# EAGLE design WeatherBoard_v2.0 (EAGLE 9.4.1)
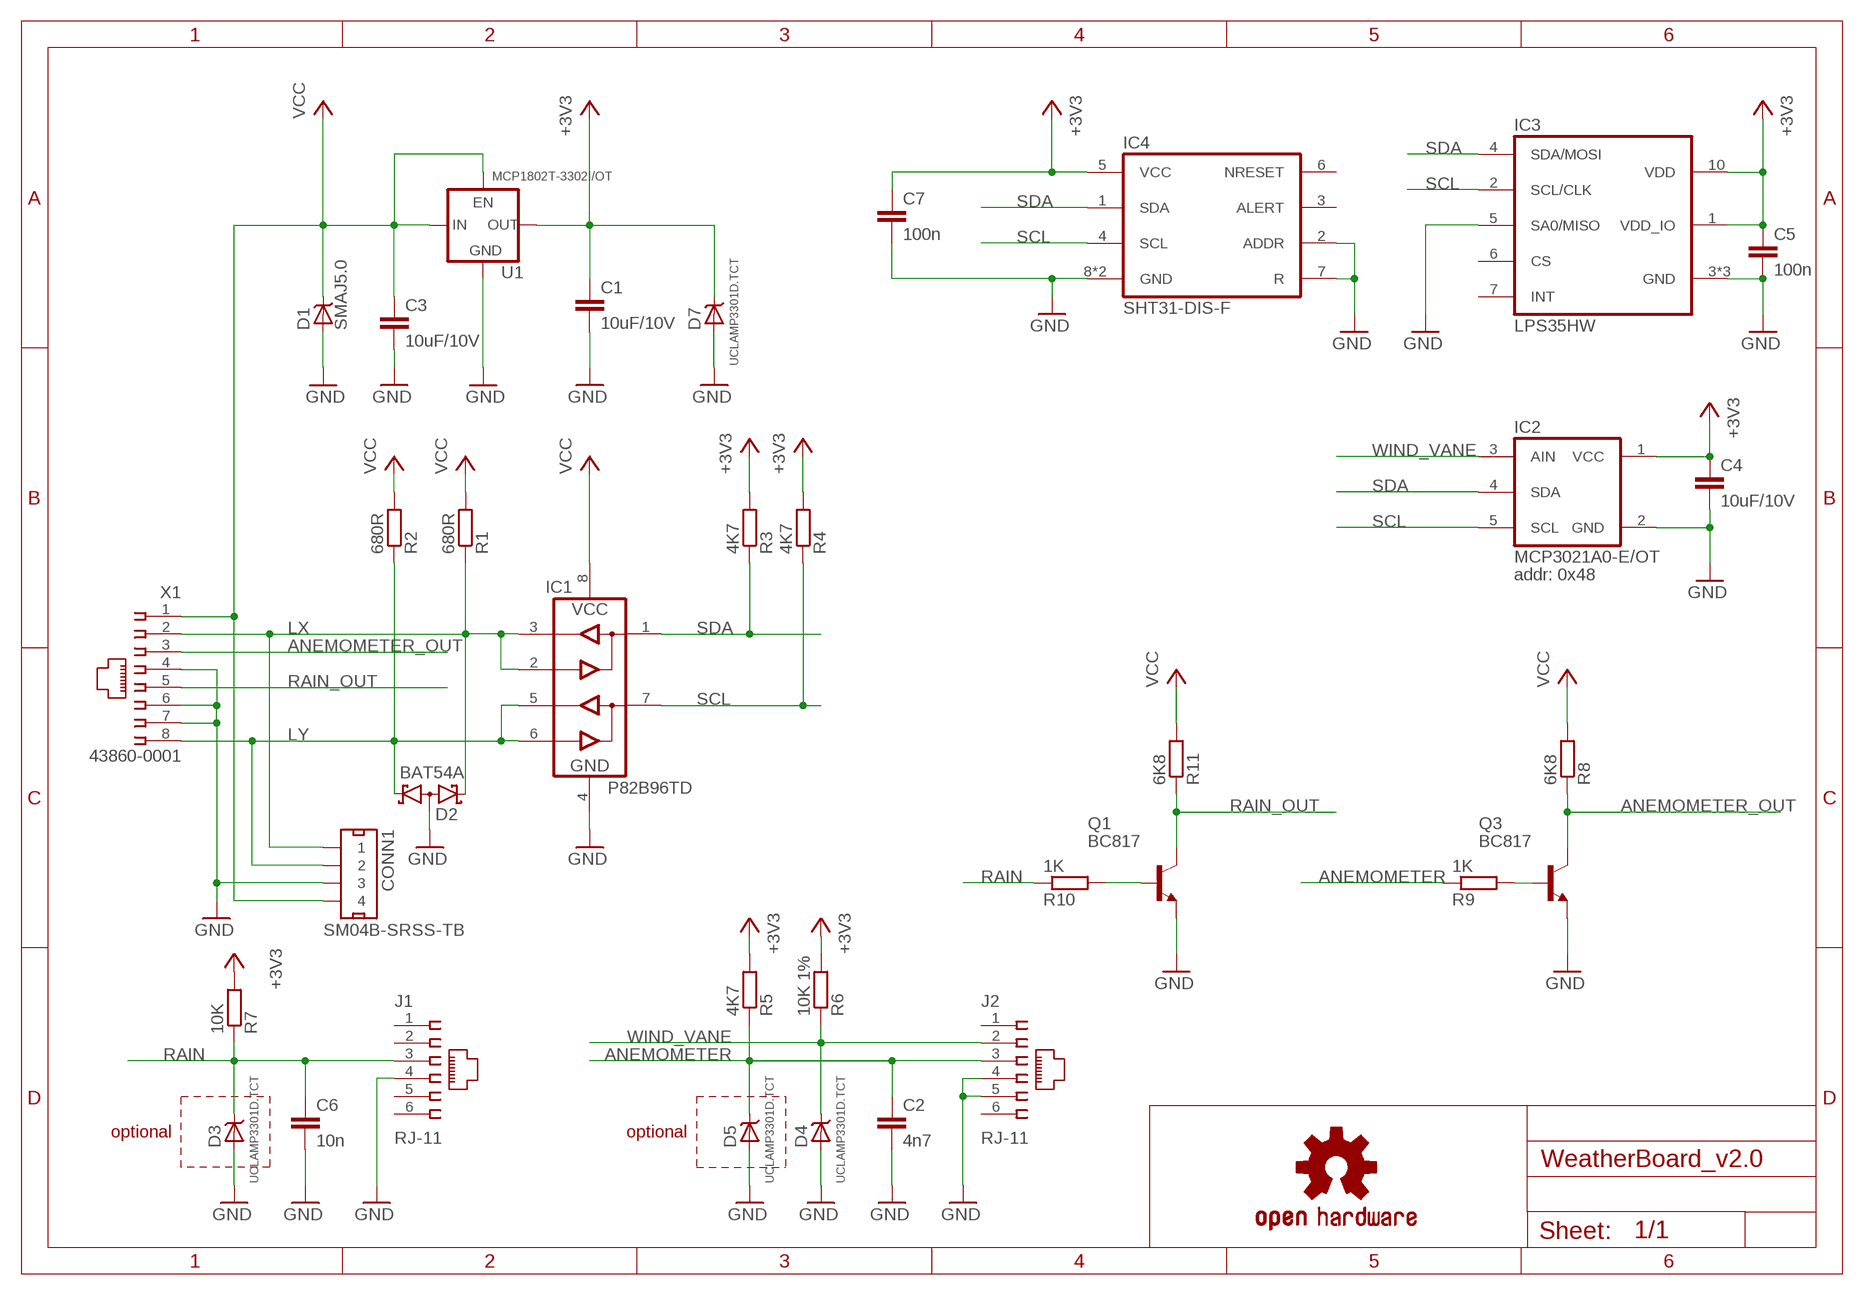
[diagram p0: schematic, sheet 1]

## Parts
C1  10uF/10V  C-EUC0805  [C0805]
C2  4n7  C-EUC0805  [C0805]
C3  10uF/10V  C-EUC0805  [C0805]
C4  10uF/10V  C-EUC0805  [C0805]
C5  100n  C-EUC0805  [C0805]
C6  10n  C-EUC0805  [C0805]
C7  100n  C-EUC0805  [C0805]
CONN1  SM04B-SRSS-TB  [JST-SRSS-4-T]
D1  SMAJ5.0  [DO214AC]
D2  BAT54A  [SOT23]
D3  UCLAMP3301D.TCT  [SOD323]
D4  UCLAMP3301D.TCT  [SOD323]
D5  UCLAMP3301D.TCT  [SOD323]
D7  UCLAMP3301D.TCT  [SOD323]
IC1  P82B96TD  [SO08]
IC2  MCP3021A0-E/OT  [SOT23-5]
IC3  LPS35HW  [CCLGA10L]
IC4  SHT31-DIS-F  SHT31-DIS  [DFN8]
J1  RJ-11  [615006138421]
J2  RJ-11  [615006138421]
LOGO1  OSHW-LOGOM-COPPER  [OSHW-LOGO-M_COPPER]
Q1  BC817  BC817-40SMD  [SOT23-BEC]
Q3  BC817  BC817-40SMD  [SOT23-BEC]
R1  680R  R-EU_R0805  [R0805]
R2  680R  R-EU_R0805  [R0805]
R3  4K7  R-EU_R0805  [R0805]
R4  4K7  R-EU_R0805  [R0805]
R5  4K7  R-EU_R0805  [R0805]
R6  10K 1%  R-EU_R0805  [R0805]
R7  10K  R-EU_R0805  [R0805]
R8  6K8  R-EU_R0805  [R0805]
R9  1K  R-EU_R0805  [R0805]
R10  1K  R-EU_R0805  [R0805]
R11  6K8  R-EU_R0805  [R0805]
U1  MCP1802T-3302I/OT  TLV70033DD  [SOT23-5]
X1  43860-0001  [MX-43860-0001]

## Nets
+3V3: C1.1 C4.1 C5.1 C7.1 D7.C IC2.1(VCC) IC3.1(VDD_IO) IC3.10(VDD) IC4.5(VCC) R3.2 R4.2 R5.2 R6.2 R7.2 U1.5(VOUT)
ANEMOMETER: C2.1 D5.C J2.3 R5.1 R9.1
ANEMOMETER_OUT: Q3.C R8.1 X1.3
GND: C1.2 C2.2 C3.2 C4.2 C5.2 C6.2 C7.2 CONN1.3 D1.A D2.3(AA) D3.A D4.A D5.A D7.A IC1.4(GND) IC2.2(GND) IC3.3(GND) IC3.5(SA0/MISO) IC3.8(GND) IC3.9(GND) IC4.2(ADDR) IC4.7(R) IC4.8(GND) IC4.PAD(GND) J1.4 J2.4 J2.5 Q1.E Q3.E U1.2(GND) X1.4 X1.6 X1.7
LX: CONN1.1 D2.2(K2) IC1.2(RX) IC1.3(TX) R1.1 X1.2
LY: CONN1.2 D2.1(K1) IC1.5(TY) IC1.6(RY) R2.1 X1.8
N$1: Q3.B R9.2
N$2: Q1.B R10.2
RAIN: C6.1 D3.C J1.3 R7.1 R10.1
RAIN_OUT: Q1.C R11.1 X1.5
SCL: IC1.7(SY) IC2.5(SCL) IC3.2(SCL/CLK) IC4.4(SCL) R4.1
SDA: IC1.1(SX) IC2.4(SDA) IC3.4(SDA/MOSI) IC4.1(SDA) R3.1
VCC: C3.1 CONN1.4 D1.C IC1.8(VCC) R1.2 R2.2 R8.2 R11.2 U1.1(VIN) U1.3(EN) X1.1
WIND_VANE: D4.C IC2.3(AIN) J2.2 R6.1
Unconnected: CONN1.NC1(PAD2) CONN1.NC2(PAD1) IC3.6(CS) IC3.7(INT) IC4.3(ALERT) IC4.6(NRESET) J1.1 J1.2 J1.5 J1.6 J2.1 J2.6

## Notes on the sheet
- addr: 0x48
- optional | optional

## Library data of the parts
C1-C7 = rcl:C-EU: CAPACITOR, European symbol; SPICEPREFIX: C
CONN1 = my-connectors:?M04B-SRSS-TB: JST SR 4 Pin Connector 1mm Pitch
D1 = my-diode:SM?J*: Transient Voltage Suppression Diode - TVS
D2 = diode:BAT54A: Schottky Diodes Source: Fairchild .. BAT54.pdf
D3-D5 D7 = my-diode:UCLAMP3301?.TCT: Low Voltage μClamp TVS diode
IC1 = my-ic:P82B96?: Dual bidirectional bus buffer
IC2 = my-ic:MCP3021*-E/?: Low-Power 10-Bit A/D Converter
IC3 = my-ic:LPS35HW: MEMS pressure sensor 260-1260 hPa absolute digital output barometer with water resistant package
IC4 = my-ic:SHT3*-DIS: Humidity and Temperature Sensor
J1 J2 = my-connectors:RJ-11
LOGO1 = SparkFun-Aesthetics:OSHW-LOGO: Open-Source Hardware (OSHW) Logo This logo indicates the piece of hardware it is found on incorporates a OSHW license and/or adheres to the definition of open source hardware found here: http://freedomdefined.org/OSHW
Q1 Q3 = transistor-npn:BC817*: NPN Transistor
R1-R11 = rcl:R-EU_: RESISTOR, European symbol; SPICEPREFIX: R
U1 = my-power:TLV700*: LDO regulator 200mA
X1 = my-connectors:43860-0001: RJ45 8P8C

## Board
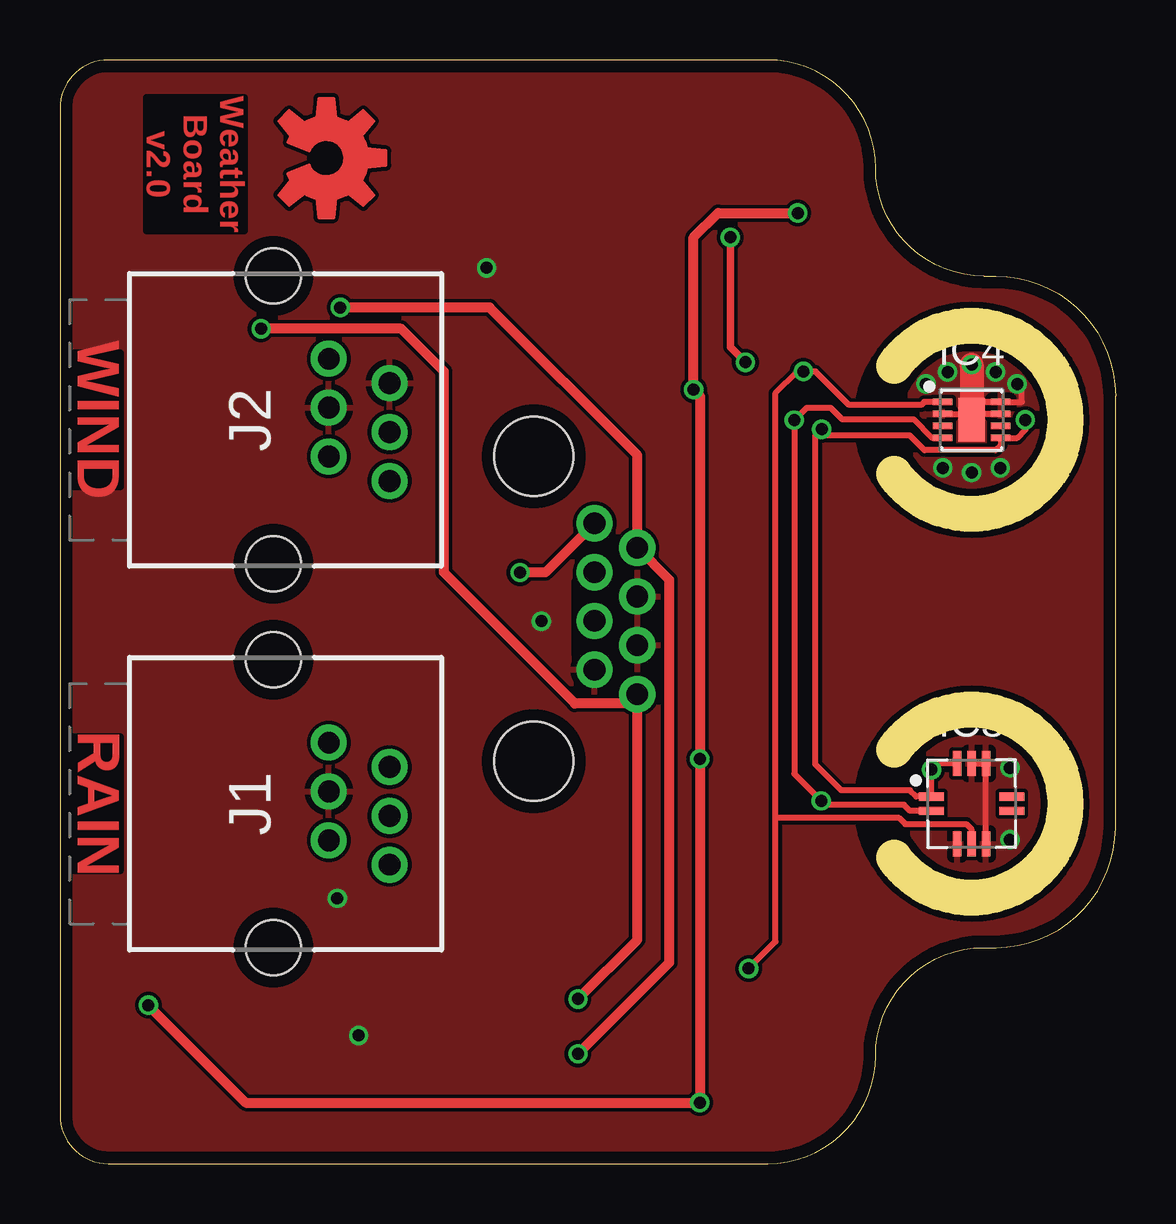
[diagram p1: board, top side]
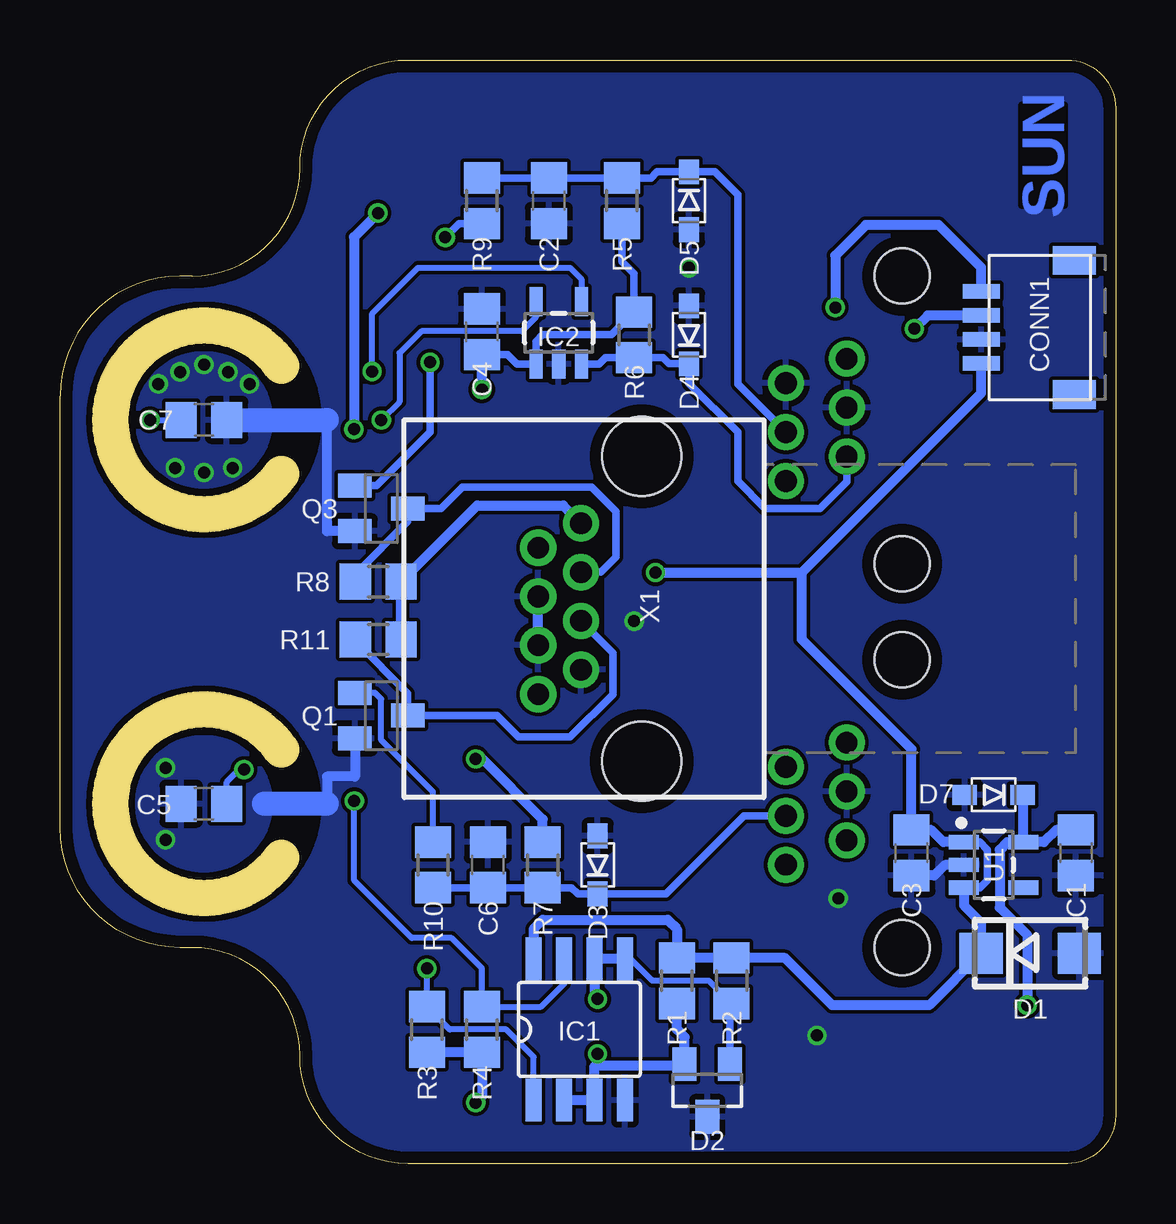
[diagram p2: board, bottom side, seen from below]

Size 44 x 46 mm. Coordinates in mm from the lower left corner, seen from the top.
Outline: 0,44 0,2 arc90 2,0 29.5,0 arc90 34,4.5 arc-90 38.5,9 39,9 arc90 44,14 44,32 arc90 39,37 38.5,37 arc-90 34,41.5 arc90 29.5,46 2,46 arc90 0,44
Copper layers (1*16): Top 0.035mm / dielectric 1.6mm / Bottom 0.035mm
Design rules "Elecrow_2-layer_PCB_eagle_rule *": minimum track width 6mil, minimum drill 12mil, track to track 6mil, track to pad 6mil, pad to pad 6mil, via to via 8mil, smd to smd 0mil, copper to edge 20mil, drill to drill 10mil, minimum pad ring 12mil, minimum via ring 6mil, stop-mask expansion 0mil, vias tented up to drill 100mil, thermal gap 10mil
Milling: 2 lines

### Footprints (pad centres in the part's own frame; a part is rotated, then mirrored left to right if it is on the bottom)
C0805 = smd 1.3 x 1.5: 1 -0.95,0; 2 0.95,0
JST-SRSS-4-T = smd 0.6 x 1.55: 1 -1.5,-2.45; 2 -0.5,-2.45; 3 0.5,-2.45; 4 1.5,-2.45 | smd 1.2 x 1.8: NC1 -2.8,1.425; NC2 2.8,1.425
DO214AC = smd 1.8 x 1.7: A 2.05,0; C -2.05,0
SOT23 = smd 1 x 1.4: 1 -0.95,-1.1; 2 0.95,-1.1; 3 0,1.1
SOD323 = smd 1.03 x 0.839: A 1.206,0; C -1.206,0
SO08 = smd 0.66 x 1.778: 1 -1.905,-2.946; 2 -0.635,-2.946; 3 0.635,-2.946; 4 1.905,-2.946; 5 1.905,2.946; 6 0.635,2.946; 7 -0.635,2.946; 8 -1.905,2.946
SOT23-5 = smd 0.55 x 1.2: 1 -0.95,-1.3; 2 0,-1.3; 3 0.95,-1.3; 4 0.95,1.3; 5 -0.95,1.3
CCLGA10L = smd 1.05 x 0.35: 1 -1.675,0.3; 2 -1.675,-0.3; 6 1.675,-0.3; 7 1.675,0.3 | smd 0.35 x 1.05: 3 -0.6,-1.675; 4 0,-1.675; 5 0.6,-1.675; 8 0.6,1.675; 9 0,1.675; 10 -0.6,1.675
DFN8 = smd 0.81 x 0.27: 1 -1.21,0.75; 2 -1.21,0.25; 3 -1.21,-0.25; 4 -1.21,-0.75; 5 1.21,-0.75; 6 1.21,-0.25; 7 1.21,0.25; 8 1.21,0.75 | smd 1.1 x 1.8: PAD 0,0
615006138421 = drill 0.9: 1 2.55,4.34; 2 1.53,1.8; 3 0.51,4.34; 4 -0.51,1.8; 5 -1.53,4.34; 6 -2.55,1.8 | hole 2.3: -6,-0.5; 6,-0.5
SOT23-BEC = smd 1 x 1.4: B -0.95,-1.1; C 0,1.1; E 0.95,-1.1
R0805 = smd 1.3 x 1.5: 1 -0.95,0; 2 0.95,0
SOT23-5' = smd 1.247 x 0.597: 1 -1.237,0.95; 2 -1.237,0; 3 -1.237,-0.95; 4 1.237,-0.95; 5 1.237,0.95
MX-43860-0001 = drill 0.9: 1 3.56,2.54; 2 2.54,4.32; 3 1.52,2.54; 4 0.51,4.32; 5 -0.51,2.54; 6 -1.52,4.32; 7 -2.54,2.54; 8 -3.56,4.32 | hole 3.3: -6.35,0; 6.35,0

### Placement (x,y rotation side)
C1  1.65,12.95 270 bottom
C2  23.62,40.13 270 bottom
C3  8.51,12.95 270 bottom
C4  26.42,34.67 90 bottom
C5  38,15 180 bottom
C6  26.16,12.45 90 bottom
C7  38,31 0 bottom
CONN1  3.15,34.85 270 bottom
D1  3.56,8.76 0 bottom
D2  17.02,3.05 180 bottom
D3  21.59,12.45 90 bottom
D4  17.78,34.54 90 bottom
D5  17.78,40.13 270 bottom
D7  5.08,15.37 180 bottom
IC1  22.35,5.59 0 bottom
IC2  23.21,34.63 0 bottom
IC3  38,15 0 top
IC4  38,31 0 top
J1  9.4,15 270 top
J2  9.4,31 270 top
LOGO1  11.1,41.91 270 top
Q1  30.61,18.67 270 bottom
Q3  30.61,27.3 270 bottom
R1  18.29,7.62 90 bottom
R2  16,7.62 90 bottom
R3  28.7,5.59 270 bottom
R4  26.42,5.59 270 bottom
R5  20.57,40.13 270 bottom
R6  20.07,34.54 90 bottom
R7  23.88,12.45 90 bottom
R8  30.73,24.26 0 bottom
R9  26.42,40.13 270 bottom
R10  28.45,12.45 90 bottom
R11  30.73,21.84 0 bottom
U1  MCP1802T-3302I/OT  [SOT23-5']  5.08,12.45 0 bottom
X1  19.74,23.13 90 bottom

### Tracks (layer width: path | path; a pad name or v marks a point on that pad's centre or on a via)
+3V3  (via drill 0.5)
  Top 0.254: IC3.10 36.59,16.68 v36.33,16.42 v36.33,16.41 IC3.1 35.69,15.3 35.44,15.55 32.56,15.55 31.48,16.64 31.48,30.34 v31.75,30.61 32,30.35 35.42,30.35 36.03,29.74 39,29.74 39.21,29.95 IC4.5 39.9,30.25 40.24,30.59 v40.24,31
  Top 0.406: v3.68,6.6 7.75,2.54 v26.67,2.54 v26.67,16.87 26.67,32 v26.42,32.26 26.42,38.61 27.43,39.62 v30.75,39.62
  Bottom 0.254: v40.24,31 C7.1 | C5.1 37.05,15.9 36.53,16.42 v36.33,16.42
  Bottom 0.305: R5.2 20.57,37.59 20.07,37.08 R6.2 21.02,34.54 23.88,34.54 24.16,34.26 IC2.1 24.95,33.33 25.34,33.72 C4.1
  Bottom 0.406: v26.67,2.54 26.42,2.79 R4.2 R3.2 | v26.42,32.26 C4.1 | R7.2 23.88,14.35 26.39,16.87 v26.67,16.87 | C1.1 2.48,13.9 2.99,13.4 U1.5 | U1.5 4.51,13.4 4.83,13.08 4.83,10.67 3.68,9.53 v3.68,6.6 | v30.75,39.62 31.75,38.62 v31.75,30.61 | D7.C 3.87,13.43 U1.5
ANEMOMETER
  Bottom 0.305: R9.1 C2.1 R5.1 19.37,41.08 19.11,41.34 D5.C 16.7,41.34 15.75,40.39 15.75,32.5 J2.3
ANEMOMETER_OUT
  Bottom 0.305: R8.1 31.68,24.58 29.51,26.75 Q3.C 28.11,27.3 27.22,28.19 21.84,28.19 20.83,27.18 20.83,25.27 21.45,24.65 X1.3
GND  (via drill 0.5)
  Top 0.254: IC3.9 IC3.8 IC3.5 | v39.9,32.5 40.1,32.5 40.1,31.75 IC4.8 38,31.75 IC4.PAD 38,31.25 | IC4.7 38,31.25 | IC4.2 38,31.25
  Top 1: v38,33.3 IC4.PAD
  Bottom 0.406: U1.2 7.11,12.45 7.55,12 C3.2 | X1.6 X1.4 | 32.87,15 32.87,16.13 31.71,16.13 Q1.E | 32.87,31 32.87,26.36 Q3.E
  Bottom 1: C7.2 32.87,31 | 32.87,15 35.5,15
  other vias: 17.78,37.34 11.56,11.05 12.45,5.33 20.07,22.61 37,33 36.1,32.5 39,33 39.2,29 38,28.8 36.8,29 39.6,16.5 39.6,13.5
  cutout Bottom: 23.75,24.26 23.75,20.45 22.73,20.45 22.73,21.21 21.46,21.21 21.46,24.26
  cutout Top: 23.75,24.26 23.75,20.45 22.73,20.45 22.73,21.21 21.46,21.21 21.46,24.26
  cutout Top: 42.8,15 arc90 38,19.8 38,18 arc-90 41,15
  cutout Top: 38,19.8 arc90 33.2,15 35,15 arc-90 38,18
  cutout Top: 33.2,15 arc90 38,10.2 38,12 arc-90 35,15
  cutout Top: 38,10.2 arc90 42.8,15 41,15 arc-90 38,12
  cutout Bottom: 33.2,15 arc-90 38,19.8 38,18 arc90 35,15
  cutout Bottom: 38,10.2 arc-90 33.2,15 35,15 arc90 38,12
  cutout Bottom: 42.8,15 arc-90 38,10.2 38,12 arc90 41,15
  cutout Bottom: 38,19.8 arc-90 42.8,15 41,15 arc90 38,18
  pour Top: 0,44 0,2 arc90 2,0 29.5,0 arc90 34,4.5 arc-90 38.5,9 39,9 arc90 44,14 44,32 arc90 39,37 38.5,37 arc-90 34,41.5 arc90 29.5,46 2,46 arc90
  pour Bottom: 0,44 0,2 arc90 2,0 29.5,0 arc90 34,4.5 arc-90 38.5,9 39,9 arc90 44,14 44,32 arc90 39,37 38.5,37 arc-90 34,41.5 arc90 29.5,46 2,46 arc90
GND2
  cutout Top: 42.8,31 arc90 38,35.8 38,34 arc-90 41,31
  cutout Top: 38,35.8 arc90 33.2,31 35,31 arc-90 38,34
  cutout Top: 33.2,31 arc90 38,26.2 38,28 arc-90 35,31
  cutout Top: 38,26.2 arc90 42.8,31 41,31 arc-90 38,28
  cutout Bottom: 38,35.8 arc-90 42.8,31 41,31 arc90 38,34
  cutout Bottom: 33.2,31 arc-90 38,35.8 38,34 arc90 35,31
  cutout Bottom: 38,26.2 arc-90 33.2,31 35,31 arc90 38,28
  cutout Bottom: 42.8,31 arc-90 38,26.2 38,28 arc90 41,31
LX  (via drill 0.5)
  Top 0.406: v21.59,4.57 25.4,8.38 25.4,24.33 X1.2 24.06,29.53 17.91,35.69 v11.68,35.69
  Bottom 0.406: 21.59,4.06 v21.59,4.57 | 21.59,4.06 18.05,4.06 D2.2 17.97,5.27 18.29,5.59 R1.1 | 21.59,4.06 21.72,4.06 IC1.3 IC1.2 | v11.68,35.69 11.68,37.85 10.41,39.12 7.37,39.12 5.6,37.35 CONN1.1
LY  (via drill 0.5)
  Top 0.406: v21.59,6.86 24.06,9.33 X1.8 23.67,19.18 21.46,19.18 16,24.64 16,33.02 14.22,34.8 v8.38,34.8
  Bottom 0.254: R2.1 16.95,7.62 19.3,7.62 20.22,8.53 IC1.5
  Bottom 0.305: D2.1 16.07,6.6 R2.1
  Bottom 0.406: v21.59,6.86 21.72,6.99 IC1.6 IC1.5 | CONN1.2 7.83,35.35 v8.38,34.8
N$1  (via drill 0.5)
  Top 0.305: v27.94,38.61 27.94,34.04 v28.57,33.4
  Bottom 0.305: R9.2 27.37,39.18 v27.94,38.61 | Q3.B 30.8,28.25 28.57,30.48 v28.57,33.4
N$2
  Bottom 0.254: R10.2 28.45,15.49 30.61,17.65 30.61,19.36 30.87,19.62 Q1.B
RAIN
  Bottom 0.305: R10.1 C6.1 R7.1 22.67,11.5 22.42,11.24 D3.C 18.73,11.24 15.48,14.49 J1.3
RAIN_OUT
  Bottom 0.305: X1.5 20.95,21.29 20.95,19.56 22.73,17.78 24.89,17.78 25.78,18.67 Q1.C 29.51,19.6 31.68,21.78 R11.1
SCL  (via drill 0.5)
  Top 0.254: IC3.2 35.44,14.7 35.18,14.95 31.89,14.95 v31.73,15.11 30.61,16.24 v30.61,30.99 31.11,31.5 32.13,31.5 32.61,31.01 35.59,31.01 36.35,30.25 IC4.4
  Bottom 0.254: IC1.7 22.99,7.49 23.94,6.54 R4.1 26.42,8.13 27.69,9.4 29.34,9.4 31.73,11.79 v31.73,15.11 | IC2.5 24.16,35.27 24.74,34.69 28.93,34.69 29.84,33.78 29.84,31.75 v30.61,30.99
SDA  (via drill 0.5)
  Top 0.254: IC4.1 36.03,31.75 35.9,31.62 32.89,31.62 31.5,33.02 v30.99,33.02 30.73,33.02 29.83,32.12 29.83,14.4 | IC3.4 38,13.93 37.78,14.15 35.24,14.15 34.98,14.4 29.83,14.4 | v28.7,8.13 29.83,9.26 29.83,14.4
  Bottom 0.254: IC1.1 24.26,4.45 25.4,5.59 27.75,5.59 R3.1 v28.7,8.13 | v30.99,33.02 30.99,35.43 29.08,37.34 22.73,37.34 22.26,36.87 IC2.4
VCC  (via drill 0.5)
  Top 0.406: X1.1 20.23,24.64 v19.18,24.64
  Bottom 0.305: U1.3 5.65,11.5 5.33,11.81 5.33,13.08 5.65,13.4 U1.1
  Bottom 0.406: IC1.8 24.26,9.78 23.88,10.16 18.67,10.16 18.29,9.78 R1.2 R2.2 13.78,8.57 11.81,6.6 7.76,6.6 D1.C 5.61,10.05 6.32,10.76 U1.3 | R11.2 R8.2 26.61,27.43 23.03,27.43 X1.1 | U1.1 7.17,13.4 7.68,13.9 C3.1 8.51,17.27 13.08,21.84 13.08,24.64 | v19.18,24.64 13.08,24.64 | CONN1.4 5.6,32.12 13.08,24.64
WIND_VANE
  Bottom 0.305: IC2.3 21.54,33.33 21.27,33.59 R6.1 18.86,33.59 18.61,33.34 D4.C 17.78,32.51 15.75,30.48 15.75,28.45 14.61,27.3 12.32,27.3 11.2,28.42 J2.2

### Text on the board
Top: Weather / Board / v2.0 | WIND | RAIN
Bottom: SUN
tStop: WIND | RAIN
bStop: SUN